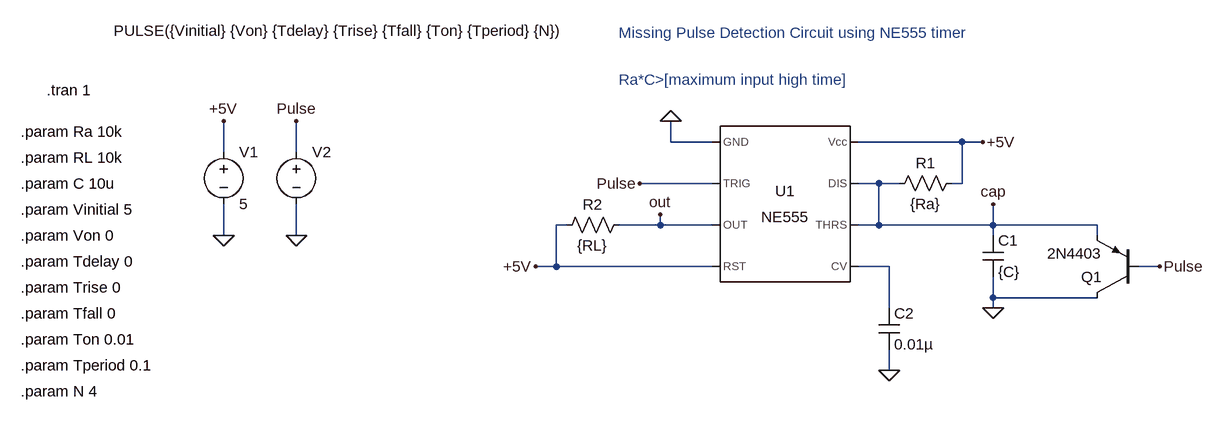
[diagram p0: schematic NE555-Missing_Pulse_Detection.asc]
NE555-Missing_Pulse_Detection.asc, the LTspice schematic file:
Version 4
SHEET 1 1328 680
WIRE 48 80 48 48
WIRE 112 80 48 80
WIRE 496 80 336 80
WIRE 528 80 496 80
WIRE -640 96 -640 48
WIRE -528 96 -528 48
WIRE 112 144 0 144
WIRE 368 144 336 144
WIRE 400 144 368 144
WIRE 496 144 496 80
WIRE 496 144 480 144
WIRE -112 208 -128 208
WIRE 32 208 32 192
WIRE 32 208 -32 208
WIRE 112 208 32 208
WIRE 368 208 368 144
WIRE 368 208 336 208
WIRE 544 208 544 176
WIRE 544 208 368 208
WIRE 704 208 544 208
WIRE -640 224 -640 176
WIRE -528 224 -528 176
WIRE 544 224 544 208
WIRE 704 224 704 208
WIRE -128 272 -128 208
WIRE -128 272 -160 272
WIRE 112 272 -128 272
WIRE 384 272 336 272
WIRE 800 272 768 272
WIRE 544 320 544 288
WIRE 704 320 544 320
WIRE 384 336 384 272
WIRE 544 336 544 320
WIRE 384 432 384 400
FLAG -640 224 0
FLAG -640 48 +5V
FLAG 528 80 +5V
FLAG 48 48 0
FLAG -160 272 +5V
FLAG -528 224 0
FLAG -528 48 Pulse
FLAG 544 336 0
FLAG 0 144 Pulse
FLAG 384 432 0
FLAG 32 192 out
FLAG 544 176 cap
FLAG 800 272 Pulse
SYMBOL Misc\\NE555 224 176 R0
SYMATTR InstName U1
SYMBOL voltage -640 80 R0
WINDOW 123 0 0 Left 0
WINDOW 39 0 0 Left 0
SYMATTR InstName V1
SYMATTR Value 5
SYMBOL res 496 128 R90
WINDOW 0 0 56 VBottom 2
WINDOW 3 32 56 VTop 2
SYMATTR InstName R1
SYMATTR Value {Ra}
SYMBOL cap 528 224 R0
SYMATTR InstName C1
SYMATTR Value {C}
SYMBOL res -16 192 R90
WINDOW 0 0 56 VBottom 2
WINDOW 3 32 56 VTop 2
SYMATTR InstName R2
SYMATTR Value {RL}
SYMBOL voltage -528 80 R0
WINDOW 123 0 0 Left 0
WINDOW 39 0 0 Left 0
WINDOW 3 420 -171 Right 2
SYMATTR Value PULSE({Vinitial} {Von} {Tdelay} {Trise} {Tfall} {Ton} {Tperiod} {N})
SYMATTR InstName V2
SYMBOL cap 368 336 R0
SYMATTR InstName C2
SYMATTR Value 0.01µ
SYMBOL pnp 768 320 R180
SYMATTR InstName Q1
SYMATTR Value 2N4403
TEXT -912 0 Left 2 !.tran 1
TEXT -952 64 Left 2 !.param Ra 10k
TEXT -952 104 Left 2 !.param RL 10k
TEXT -952 144 Left 2 !.param C 10u
TEXT -952 184 Left 2 !.param Vinitial 5
TEXT -952 224 Left 2 !.param Von 0
TEXT -952 264 Left 2 !.param Tdelay 0
TEXT -952 304 Left 2 !.param Trise 0
TEXT -952 344 Left 2 !.param Tfall 0
TEXT -952 384 Left 2 !.param Ton 0.01
TEXT -952 424 Left 2 !.param Tperiod 0.1
TEXT -952 464 Left 2 !.param N 4
TEXT -32 -16 Left 2 ;Ra*C>[maximum input high time]
TEXT -32 -88 Left 2 ;Missing Pulse Detection Circuit using NE555 timer

The netlist it stands for:
* NE555-Missing_Pulse_Detection.asc
XU1 0 Pulse out +5V N001 cap cap +5V NE555  ; pins GND TRIG OUT RST CV THRS DIS Vcc
V1 +5V 0 5
R1 +5V cap {Ra}
C1 cap 0 {C}
R2 out +5V {RL}
V2 Pulse 0 PULSE({Vinitial} {Von} {Tdelay} {Trise} {Tfall} {Ton} {Tperiod} {N})
C2 N001 0 0.01µ
Q1 0 Pulse cap 0 2N4403
.model NPN NPN
.model PNP PNP
.lib standard.bjt
.tran 1
.param Ra 10k
.param RL 10k
.param C 10u
.param Vinitial 5
.param Von 0
.param Tdelay 0
.param Trise 0
.param Tfall 0
.param Ton 0.01
.param Tperiod 0.1
.param N 4
* Ra*C>[maximum input high time]
* Missing Pulse Detection Circuit using NE555 timer
.lib NE555.sub
.backanno
.end